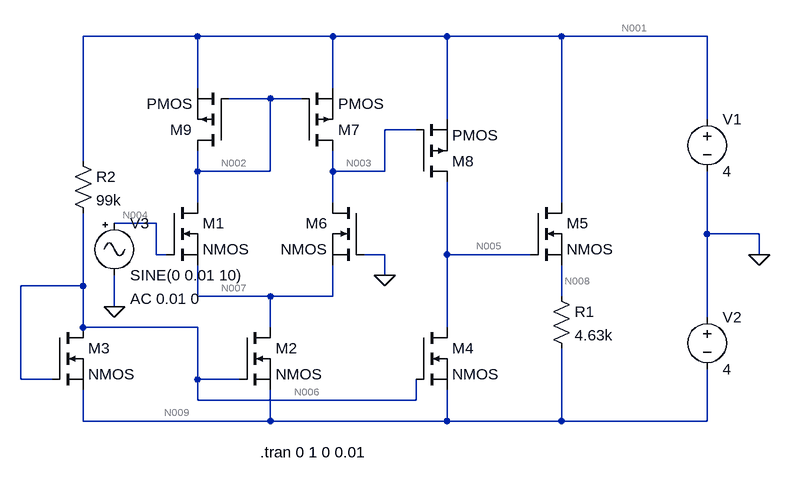
[diagram p0: schematic opamp.asc]
opamp.asc, the LTspice schematic file:
Version 4
SHEET 1 1028 680
WIRE 144 -240 -32 -240
WIRE 352 -240 144 -240
WIRE 528 -240 352 -240
WIRE 704 -240 528 -240
WIRE 928 -240 704 -240
WIRE 144 -160 144 -240
WIRE 352 -160 352 -240
WIRE 256 -144 192 -144
WIRE 304 -144 256 -144
WIRE 528 -112 528 -240
WIRE 928 -112 928 -240
WIRE 480 -96 432 -96
WIRE -32 -48 -32 -240
WIRE 144 -32 144 -64
WIRE 256 -32 256 -144
WIRE 256 -32 144 -32
WIRE 352 -32 352 -64
WIRE 432 -32 432 -96
WIRE 432 -32 352 -32
WIRE 144 16 144 -32
WIRE 352 16 352 -32
WIRE 704 16 704 -240
WIRE 80 48 16 48
WIRE 928 64 928 -32
WIRE 1008 64 928 64
WIRE 80 96 80 48
WIRE 96 96 80 96
WIRE 432 96 400 96
WIRE 528 96 528 -16
WIRE 656 96 528 96
WIRE 1008 96 1008 64
WIRE 432 128 432 96
WIRE -32 144 -32 32
WIRE -32 144 -128 144
WIRE 144 160 144 112
WIRE 256 160 144 160
WIRE 352 160 352 112
WIRE 352 160 256 160
WIRE 704 160 704 112
WIRE 16 176 16 128
WIRE 928 192 928 64
WIRE -32 208 -32 144
WIRE 144 208 -32 208
WIRE 256 208 256 160
WIRE 528 208 528 96
WIRE -128 288 -128 144
WIRE -80 288 -128 288
WIRE 144 288 144 208
WIRE 208 288 144 288
WIRE 144 320 144 288
WIRE 480 320 480 288
WIRE 480 320 144 320
WIRE -32 352 -32 304
WIRE 256 352 256 304
WIRE 256 352 -32 352
WIRE 528 352 528 304
WIRE 528 352 256 352
WIRE 704 352 704 240
WIRE 704 352 528 352
WIRE 928 352 928 272
WIRE 928 352 704 352
FLAG 1008 96 0
FLAG 432 128 0
FLAG 16 176 0
SYMBOL nmos 96 16 R0
SYMATTR InstName M1
SYMBOL nmos 208 208 R0
SYMATTR InstName M2
SYMBOL nmos -80 208 R0
SYMATTR InstName M3
SYMBOL nmos 480 208 R0
SYMATTR InstName M4
SYMBOL nmos 656 16 R0
SYMATTR InstName M5
SYMBOL nmos 400 16 M0
SYMATTR InstName M6
SYMBOL pmos 304 -64 M180
SYMATTR InstName M7
SYMBOL pmos 480 -16 M180
SYMATTR InstName M8
SYMBOL pmos 192 -64 R180
SYMATTR InstName M9
SYMBOL res 688 144 R0
SYMATTR InstName R1
SYMATTR Value 4.63k
SYMBOL res -48 -64 R0
SYMATTR InstName R2
SYMATTR Value 99k
SYMBOL voltage 928 -128 R0
WINDOW 123 0 0 Left 0
WINDOW 39 0 0 Left 0
SYMATTR InstName V1
SYMATTR Value 4
SYMBOL voltage 928 176 R0
WINDOW 123 0 0 Left 0
WINDOW 39 0 0 Left 0
SYMATTR InstName V2
SYMATTR Value 4
SYMBOL Misc\\signal 16 32 R0
WINDOW 123 24 132 Left 2
WINDOW 39 0 0 Left 0
SYMATTR InstName V3
SYMATTR Value SINE(0 0.01 10)
SYMATTR Value2 AC 0.01 0
TEXT 240 400 Left 2 !.tran 0 1 0 0.01

The netlist it stands for:
* opamp.asc
M1 N002 N004 N007 N007 NMOS
M2 N007 N006 N009 N009 NMOS
M3 N006 N006 N009 N009 NMOS
M4 N005 N006 N009 N009 NMOS
M5 N001 N005 N008 N008 NMOS
M6 N003 0 N007 N007 NMOS
M7 N003 N002 N001 N001 PMOS
M8 N005 N003 N001 N001 PMOS
M9 N002 N002 N001 N001 PMOS
R1 N008 N009 4.63k
R2 N001 N006 99k
V1 N001 0 4
V2 0 N009 4
V3 N004 0 SINE(0 0.01 10) AC 0.01 0
.model NMOS NMOS
.model PMOS PMOS
.lib standard.mos
.tran 0 1 0 0.01
.backanno
.end

* Results of the author's LTspice run, read from the files saved beside the schematic
* Operating Point, zero values left out:
*   V(n002) = 2.316 V
*   V(n007) = -1.684 V
*   V(n006) = -1.618 V
*   V(n009) = -4 V
*   V(n005) = -3.303 V
*   V(n001) = 4 V
*   V(n008) = -3.979 V
*   V(n003) = 2.316 V
*   Id(M9) = -28.35 µA
*   Ib(M9) = 1.694 pA
*   Is(M9) = 28.35 µA
*   Id(M8) = -28.35 µA
*   Ib(M8) = 7.313 pA
*   Is(M8) = 28.35 µA
*   Id(M7) = -28.35 µA
*   Ib(M7) = 1.694 pA
*   Is(M7) = 28.35 µA
*   Id(M6) = 28.35 µA
*   Ib(M6) = -4.01 pA
*   Is(M6) = -28.35 µA
*   Id(M5) = 4.569 µA
*   Ib(M5) = -7.989 pA
*   Is(M5) = -4.569 µA
*   Id(M4) = 28.35 µA
*   Is(M4) = -28.35 µA
*   Id(M3) = 56.75 µA
*   Ib(M3) = -2.392 pA
*   Is(M3) = -56.75 µA
*   Id(M2) = 56.7 µA
*   Ib(M2) = -2.326 pA
*   Is(M2) = -56.7 µA
*   Id(M1) = 28.35 µA
*   Ib(M1) = -4.01 pA
*   Is(M1) = -28.35 µA
*   I(R2) = 56.75 µA
*   I(R1) = 4.569 µA
*   I(V2) = -146.4 µA
*   I(V1) = -146.4 µA
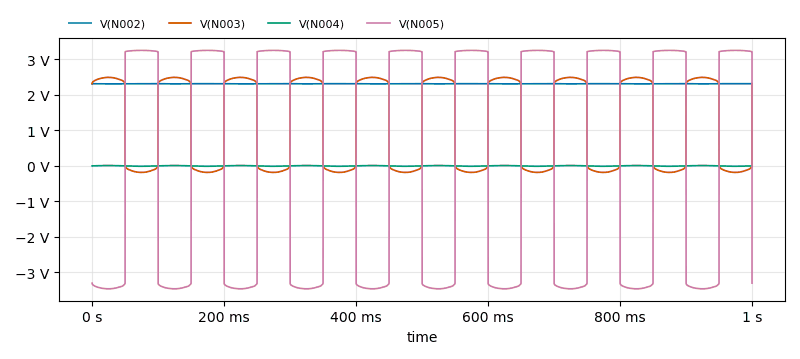
[diagram p1: Transient Analysis of opamp.asc, plotted from the saved traces]
* Transient Analysis, 1 run:
*   V(N002): min 2.311 V, max 2.316 V, average 2.315 V, rms 2.315 V, last 2.316 V
*   V(N003): min -183.1 mV, max 2.494 V, average 1.157 V, rms 1.735 V, last 2.316 V
*   V(N004): min -9.98 mV, max 9.98 mV, average -225.6 nV, rms 7.092 mV, last 0 V
*   V(N005): min -3.464 V, max 3.255 V, average -90.22 mV, rms 3.336 V, last -3.303 V